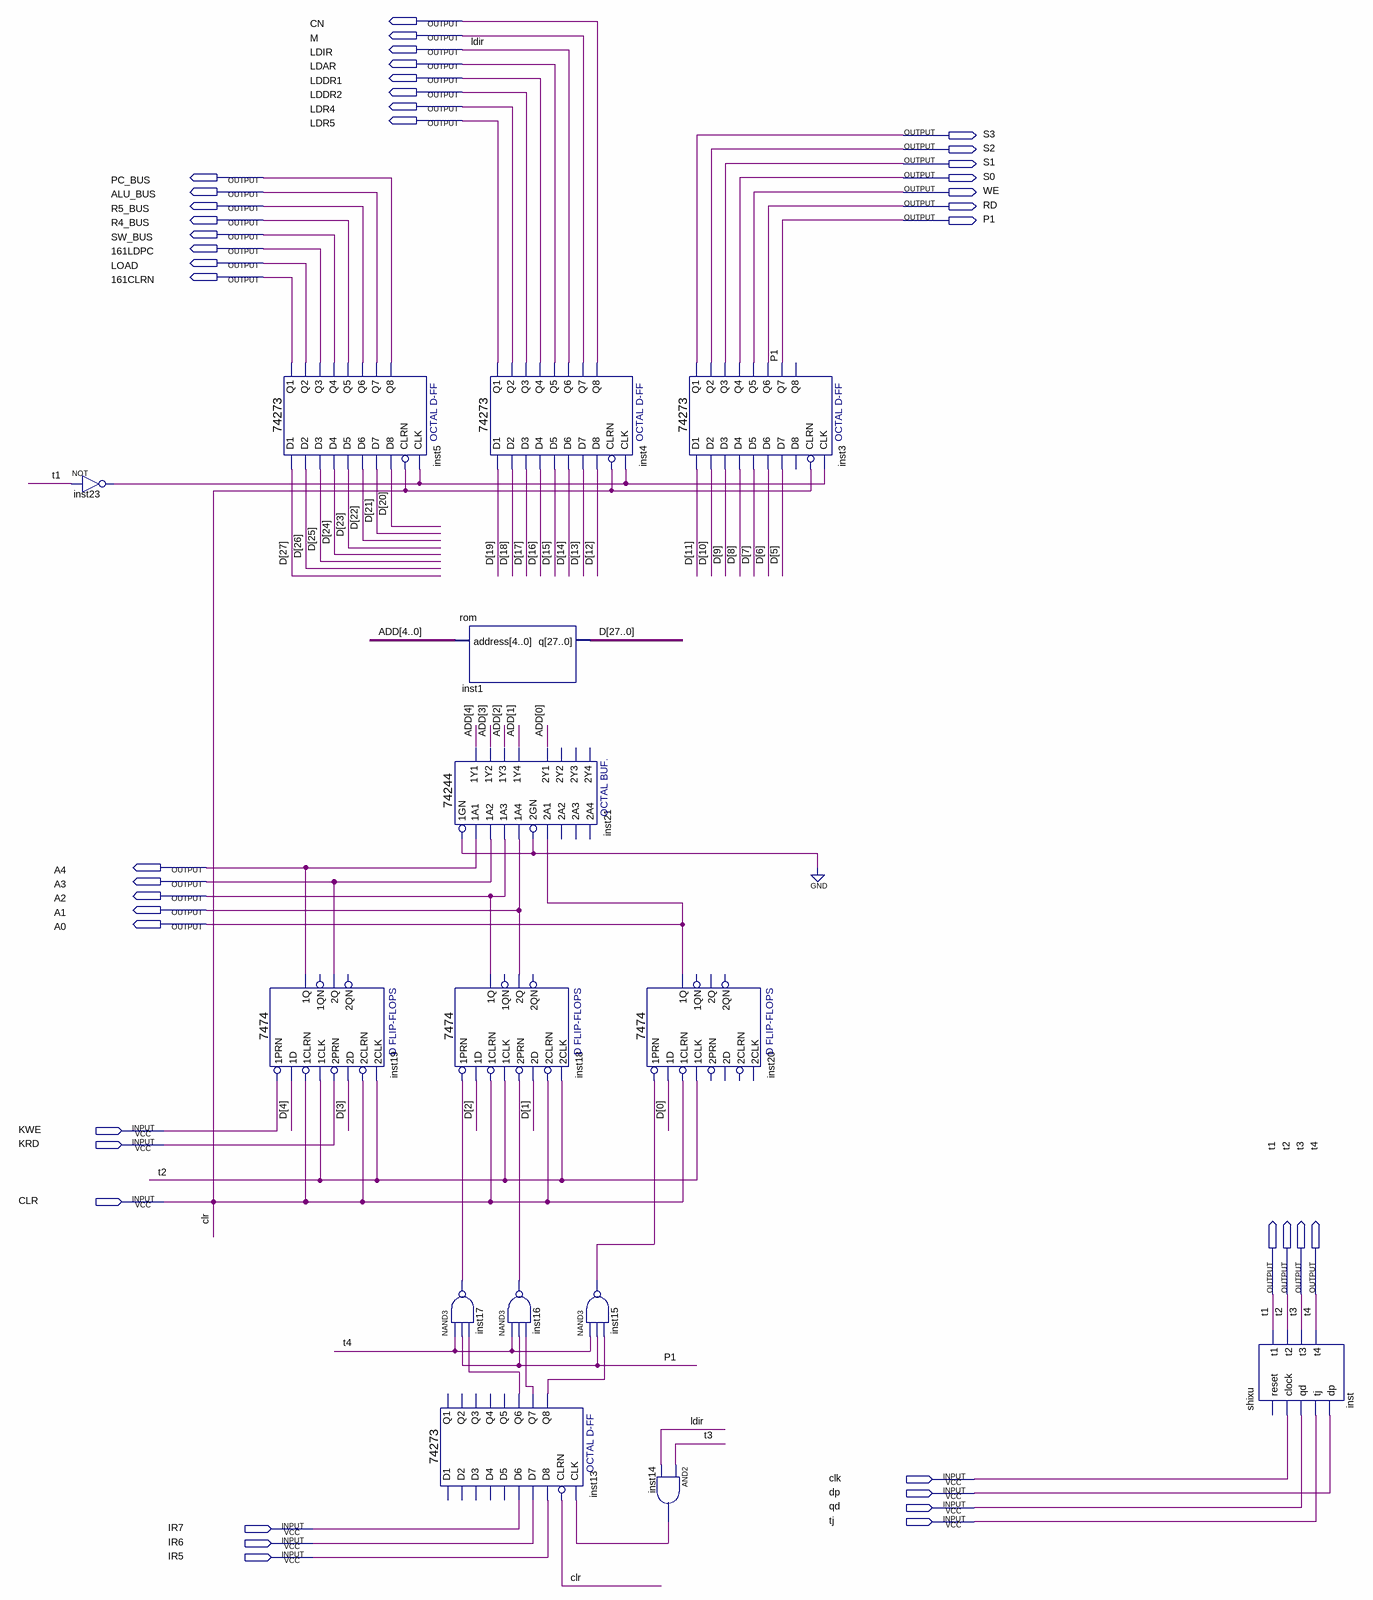
[diagram p0: schematic sheet]
// Quartus schematic weikong.bdf as structural Verilog: 15 symbols, 42 pins
module weikong (
  input  KWE,
  input  KRD,
  input  CLR,
  input  clk,
  input  dp,
  input  qd,
  input  tj,
  input  IR7,
  input  IR6,
  input  IR5,
  output CN,
  output M,
  output LDIR,
  output LDAR,
  output LDDR1,
  output LDDR2,
  output LDR4,
  output LDR5,
  output S3,
  output S2,
  output S1,
  output PC_BUS,
  output S0,
  output ALU_BUS,
  output WE,
  output R5_BUS,
  output RD,
  output R4_BUS,
  output P1,
  output SW_BUS,
  output \161LDPC ,
  output LOAD,
  output \161CLRN ,
  output A4,
  output A3,
  output A2,
  output A1,
  output A0,
  output t1,
  output t2,
  output t3,
  output t4
);

  wire inst13_q6, inst13_q7, inst13_q8, inst14_out, inst15_out, inst16_out, inst17_out, inst23_out;
  wire [4:0] ADD;
  wire [27:0] D;

  not inst23 (inst23_out, t1);
  \74273  inst5 (
    .D2(D[26]), .D3(D[25]), .D1(D[27]), .D4(D[24]), .D7(D[21]), .D6(D[22]), .D5(D[23]), .D8(D[20]),
    .CLK(inst23_out), .CLRN(CLR), .Q4(SW_BUS), .Q1(\161CLRN ), .Q2(LOAD), .Q3(\161LDPC ), .Q6(R5_BUS),
    .Q5(R4_BUS), .Q7(ALU_BUS), .Q8(PC_BUS));
  \7474  inst19 (
    .\2D (D[3]), .\2PRN (KRD), .\1CLK (t2), .\1D (D[4]), .\1PRN (KWE), .\2CLK (t2), .\2CLRN (CLR),
    .\1CLRN (CLR), .\2Q (A3), .\1Q (A4));  // open: 1QN, 2QN
  rom inst1 (.address(ADD), .q(D));
  \74244  inst21 (
    .\1A2 (A3), .\1A4 (A1), .\1A1 (A4), .\1A3 (A2), .\1GN (1'b0), .\2GN (1'b0), .\2A1 (A0), .\1Y2 (ADD[3]),
    .\1Y4 (ADD[1]), .\2Y1 (ADD[0]), .\1Y1 (ADD[4]), .\1Y3 (ADD[2]));  // open: 2A3, 2A4, 2A2, 2Y3, 2Y4, 2Y2
  \7474  inst18 (
    .\2D (D[1]), .\2PRN (inst16_out), .\1CLK (t2), .\1D (D[2]), .\1PRN (inst17_out), .\2CLK (t2),
    .\2CLRN (CLR), .\1CLRN (CLR), .\2Q (A1), .\1Q (A2));  // open: 1QN, 2QN
  nand inst17 (inst17_out, t4, P1, inst13_q6);
  \74273  inst13 (
    .D7(IR6), .D6(IR7), .D8(IR5), .CLK(inst14_out), .CLRN(CLR), .Q6(inst13_q6), .Q7(inst13_q7), .Q8(inst13_q8));  // open: D2, D3, D1, D4, D5, Q4, Q1, Q2, Q3, Q5
  \74273  inst4 (
    .D2(D[18]), .D3(D[17]), .D1(D[19]), .D4(D[16]), .D7(D[13]), .D6(D[14]), .D5(D[15]), .D8(D[12]),
    .CLK(inst23_out), .CLRN(CLR), .Q4(LDDR1), .Q1(LDR5), .Q2(LDR4), .Q3(LDDR2), .Q6(LDIR), .Q5(LDAR), .Q7(M),
    .Q8(CN));
  nand inst16 (inst16_out, t4, P1, inst13_q7);
  nand inst15 (inst15_out, t4, P1, inst13_q8);
  \7474  inst20 (
    .\1CLK (t2), .\1D (D[0]), .\1PRN (inst15_out), .\1CLRN (CLR), .\1Q (A0));  // open: 2D, 2PRN, 2CLK, 2CLRN, 1QN, 2Q, 2QN
  \74273  inst3 (
    .D2(D[10]), .D3(D[9]), .D1(D[11]), .D4(D[8]), .D7(D[5]), .D6(D[6]), .D5(D[7]), .CLK(inst23_out),
    .CLRN(CLR), .Q4(S0), .Q1(S3), .Q2(S2), .Q3(S1), .Q6(RD), .Q5(WE), .Q7(P1));  // open: D8, Q8
  and inst14 (inst14_out, t3, LDIR);
  shixu inst (.clock(clk), .qd(qd), .tj(tj), .dp(dp), .t1(t1), .t2(t2), .t3(t3), .t4(t4));  // open: reset
endmodule
